# EAGLE design Smarttree_CMU_4 (EAGLE 7.3.0)
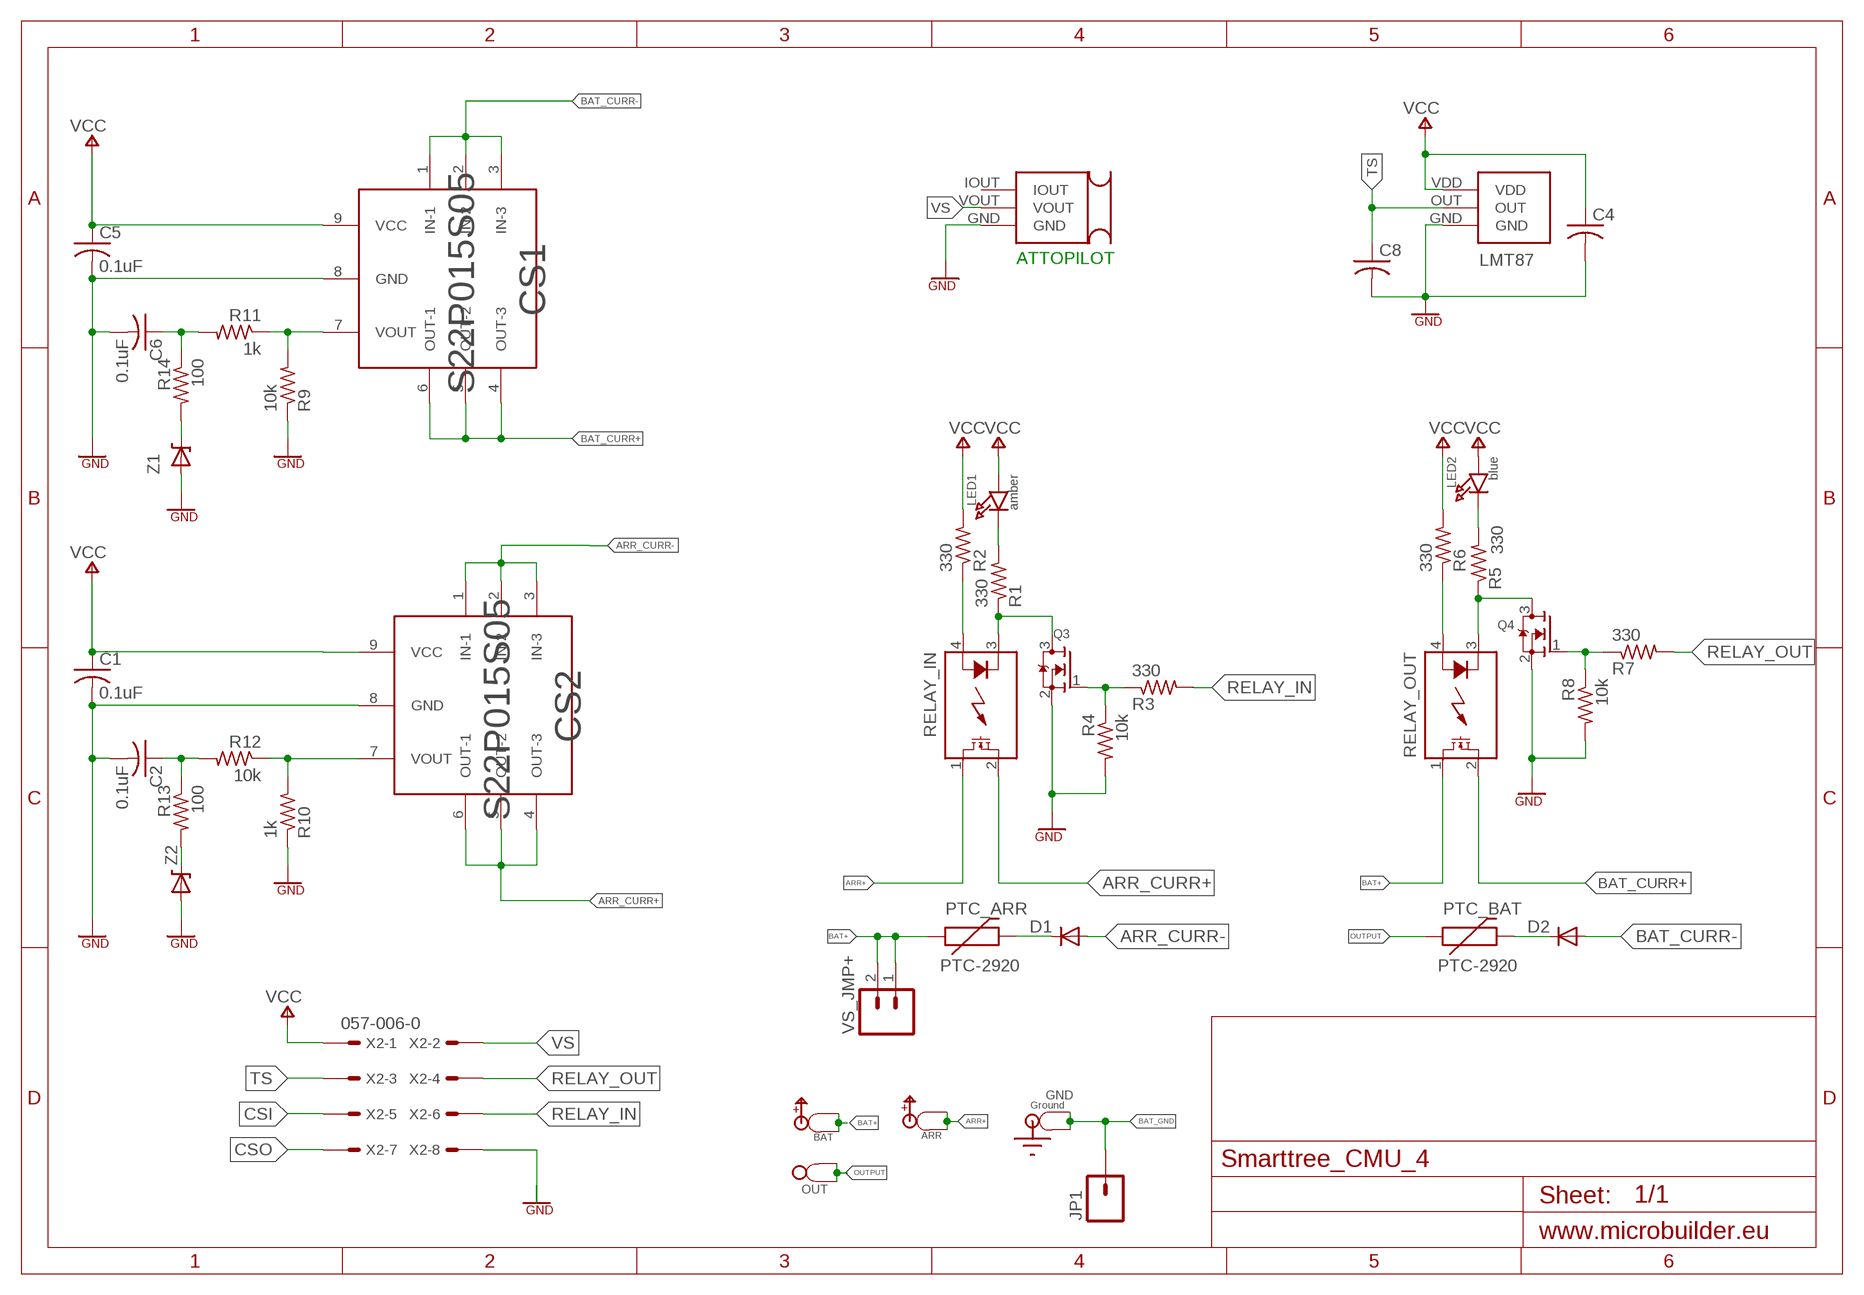
[diagram p0: schematic, sheet 1]

## Parts
ARR  SPADE-POWER  [SPADE-POWER]
ATTOPILOT  ATTOPILOT_VOLT  [TH_BKOT]
BAT  SPADE-POWER  [SPADE-POWER]
C1  0.1uF  C-USC0805  [C0805]
C2  0.1uF  C-USC0805  [C0805]
C4  C-USC0805  [C0805]
C5  0.1uF  C-USC0805  [C0805]
C6  0.1uF  C-USC0805  [C0805]
C8  C-USC0805  [C0805]
CS1  S22P015S05  [S22P015S05]
CS2  S22P015S05  [S22P015S05]
D1  DIODE-SOD106-R  [SOD106-R]
D2  DIODE-SOD106-R  [SOD106-R]
GND  SPADE-GROUND  [SPADE-GROUND]
JP1  M01OFFSET  [1X01_OFFSET]
LED1  amber  LED0805  [CHIPLED_0805]
LED2  blue  LED0805  [CHIPLED_0805]
LMT87  LMT87_PAC  [LMT87_TO]
OUT  SPADE-TERMINALPTH  [SPADE-TERMINAL]
PTC_ARR  PTC-2920  [PTC-2920]
PTC_BAT  PTC-2920  [PTC-2920]
Q3  MOSFET-NREFLOW  [SOT23]
Q4  MOSFET-NREFLOW  [SOT23]
R1  330  R-US_R0805  [R0805]
R2  330  R-US_R0805  [R0805]
R3  330  R-US_R0805  [R0805]
R4  10k  R-US_R0805  [R0805]
R5  330  R-US_R0805  [R0805]
R6  330  R-US_R0805  [R0805]
R7  330  R-US_R0805  [R0805]
R8  10k  R-US_R0805  [R0805]
R9  10k  R-US_R0805  [R0805]
R10  1k  R-US_R0805  [R0805]
R11  1k  R-US_R0805  [R0805]
R12  10k  R-US_R0805  [R0805]
R13  100  R-US_R0805  [R0805]
R14  100  R-US_R0805  [R0805]
RELAY_IN  CPC1708J  [I4-PAC]
RELAY_OUT  CPC1708J  [I4-PAC]
VS_JMP+  M02  [1X02_LONGPADS]
X2  057-006-0  [057-006-0]
Z1  DIODE-ZENER-BZT52  [SOD-323]
Z2  DIODE-ZENER-BZT52  [SOD-323]

## Nets
ARR+ [Power]: ARR.P$1 ARR.P$2 RELAY_IN.1(DS1)
ARR_CURR+ [Power]: CS2.4(OUT-3) CS2.5(OUT-2) CS2.6(OUT-1) RELAY_IN.2(DS2)
ARR_CURR- [Power]: CS2.1(IN-1) CS2.2(IN-2) CS2.3(IN-3) D1.A
BAT+ [Power]: BAT.P$1 BAT.P$2 PTC_ARR.1 RELAY_OUT.1(DS1) VS_JMP+.1 VS_JMP+.2
BAT_CURR+ [Power]: CS1.4(OUT-3) CS1.5(OUT-2) CS1.6(OUT-1) RELAY_OUT.2(DS2)
BAT_CURR-: CS1.1(IN-1) CS1.2(IN-2) CS1.3(IN-3) D2.A
BAT_GND [Power]: GND.P$1 GND.P$2 JP1.1
CSI: C2.1 R12.2 R13.1 X2.5
CSO: C6.1 R11.2 R14.1 X2.8
GND: ATTOPILOT.GND C1.2 C2.2 C4.2 C5.2 C6.2 C8.2 CS1.8(GND) CS2.8(GND) LMT87.GND Q3.2(S) Q4.2(S) R4.2 R8.2 R9.1 R10.1 X2.7 Z1.2(A) Z2.2(A)
N$1: Q3.3(D) R1.1 RELAY_IN.3(K)
N$2: Q4.3(D) R5.1 RELAY_OUT.3(K)
N$3: LED1.C R1.2
N$4: R2.1 RELAY_IN.4(A)
N$5: LED2.C R5.2
N$6: Q3.1(G) R3.1 R4.1
N$7: R6.1 RELAY_OUT.4(A)
N$8: Q4.1(G) R7.1 R8.1
N$9: R13.2 Z2.1(C)
N$10 [Power]: D2.C PTC_BAT.2
N$11 [Power]: D1.C PTC_ARR.2
N$12: CS1.7(VOUT) R9.2 R11.1
N$13: CS2.7(VOUT) R10.2 R12.1
N$14: R14.2 Z1.1(C)
OUTPUT [Power]: OUT.P$1 OUT.P$2 PTC_BAT.1
RELAY_IN: R3.2 X2.6
RELAY_OUT: R7.2 X2.4
TS: C8.1 LMT87.OUT X2.3
VCC: C1.1 C4.1 C5.1 CS1.9(VCC) CS2.9(VCC) LED1.A LED2.A LMT87.VDD R2.2 R6.2 X2.1 ; supply symbol labelled 5V
VS: ATTOPILOT.VOUT X2.2
Unconnected: ATTOPILOT.IOUT

## Library data of the parts
ARR BAT = Spade-terminals:SPADE-POWER: 0.25" SPADE
ATTOPILOT = Francis-Project:ATTOPILOT_VOLT
C1 C2 C4-C6 C8 = adafruit:C-US: CAPACITOR, American symbol
CS1 CS2 = Allen:S22P015S05
D1 D2 = diode:DIODE-: DIODE
GND = Spade-terminals:SPADE-GROUND: 0.25" spade terminal
JP1 = SparkFun:M01: Header 1 Standard 1-pin 0.1" header. Use with straight break away headers (SKU : PRT-00116), right angle break away headers (PRT-00553), swiss pins (PRT-00743), machine pins (PRT-00117), and female headers (PRT-00115).
LED1 LED2 = microbuilder:LED: LED 0603 - 0603 Surface Mount Package 2mA: Green LED - Low Power (3.9mcd, 2ma, 1.7Vf) - Digikey: 475-2709-2-ND Orange LED - Low Power (9.8mcd, 2ma, 1.8Vf) - Digikey: 475-1194-2-ND Red LED - Low Power (5mcd, 2ma, 1.8Vf) - Digikey: 475-1195-2-ND Yellow LED - Low Power (7mcd, 2ma, 1.8Vf) - Digikey: 475-1196-2-ND 5mA: Blue LED - Low Power (17mcd, 5ma, 2.9Vf) - Digikey: LNJ937W8CRACT-ND 0805 - 0805 Surface Mount Package 2mA: Red LED (8.8mcd, 2mA, 1.8Vf, Clear) - Low Power [Digikey: 475-2510-1-ND] Green LED (5mcd, 2mA, 1.8Vf, Clear) - Low Power [Digikey: 475-2730-1-ND] Yellow LED (11.3mcd, 2mA, 1.8Vf, Clear) - Low Power [Digikey: 475-2555-1-ND] 20mA: Red LED (104mcd, 20mA, Diffused) - LS R976 [Digikey: 475-1278-6-ND] Red LED (12mcd, 20mA, 2.0Vf, Clear) - APT2012EC [Digikey: 754-1128-1-ND] Green LED (15mcd, 20mA, 2.2Vf, Clear) - APT2012GC [Digikey: 754-1131-1-ND] Orange LED (160mcd, 20mA, 2.1Vf, Clear) - APT2012SECK [Digikey: 754-1130-1-ND] 1206 - 1206 Surface Mount Package Green LED (26mcd, 20mA, Diffused) - LG N971 [Digikey: 475-1407-6-ND] Red LED (15mcd, 20mA, Diffused) - LH N974 [Digikey: 475-1416-6-ND]
LMT87 = nick:LMT87_PAC
OUT = Spade-terminals:SPADE-TERMINAL: 0.25" Spade,with connections for both legs, Pls share any updates with mosaicmerc@yahoo.com
PTC_ARR PTC_BAT = SparkFun:PTC-2920
Q3 Q4 = adafruit:MOSFET-N: N-Channel Mosfet 2N7002E - 60V 260mA SOT23 [Digikey: 2N7002ET1GOSTR-ND] - REEL BSH103 - 30V 850mA SOT23 [Digikey: 568-5013-1-ND]
R1-R14 = adafruit:R-US_: RESISTOR, American symbol
RELAY_IN RELAY_OUT = relay:CPC1708J: Single-Pole, Normally Open i4-PAC (TM) DC Power Relay Source: Data sheet <http://www.clare.com/home/pdfs.nsf/www/CPC1708.pdf/$file/CPC1708.pdf>
VS_JMP+ = SparkFun:M02: Header 2 Standard 2-pin 0.1" header. Use with straight break away headers (SKU : PRT-00116), right angle break away headers (PRT-00553), swiss pins (PRT-00743), machine pins (PRT-00117), and female headers (PRT-00115). Molex polarized connector foot print use with SKU : PRT-08233 with associated crimp pins and housings.
X2 = con-panduit:057-006-: CONNECTOR 6-pin series 057 contact pc board low profile headers
Z1 Z2 = SparkFun:DIODE-ZENER: Zener Diode Production Part - 8199 3.4V Zener Voltage

## Net classes
0 default: width 0.406 mm, clearance 0.127 mm
1 Power: width 2.54 mm, clearance 0.635 mm

## Board
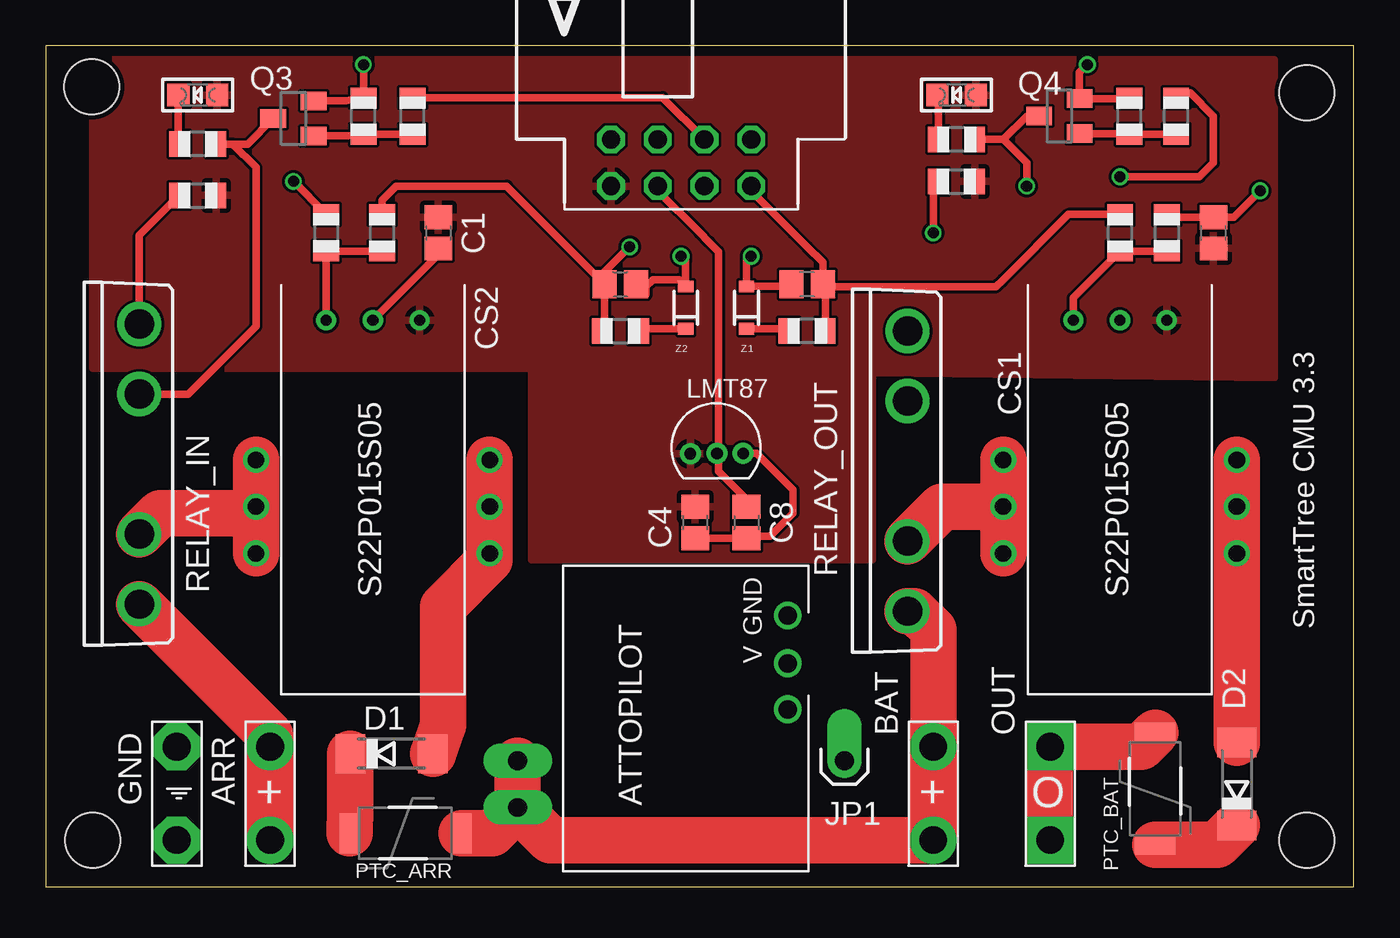
[diagram p1: board, top side]
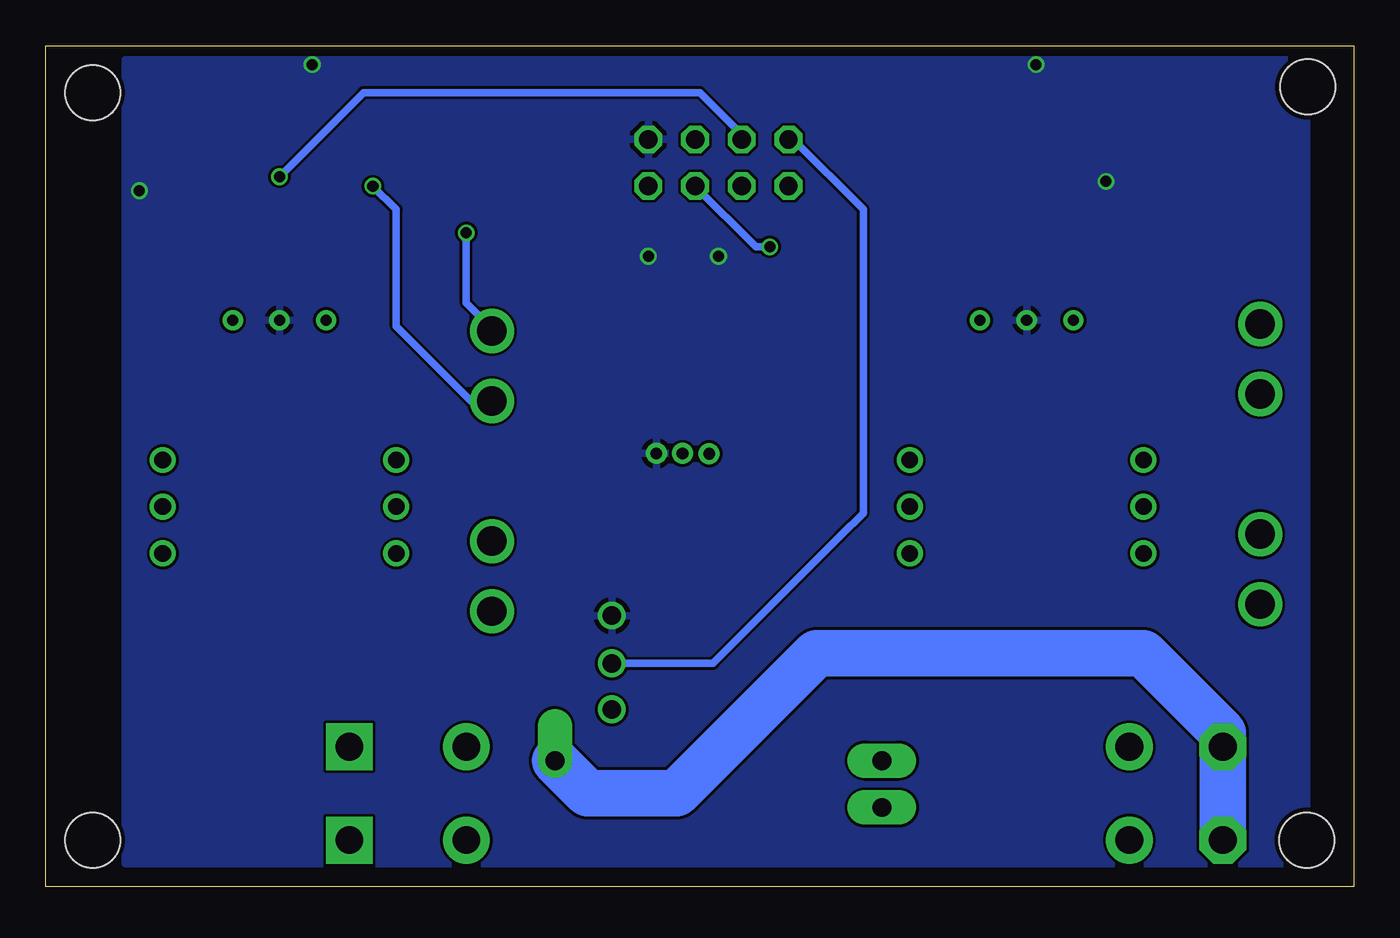
[diagram p2: board, bottom side, seen from below]

Size 71.12 x 45.72 mm. Coordinates in mm from the lower left corner, seen from the top.
Outline: 0,0 71.12,0 71.12,45.72 0,45.72 0,0
Copper layers (1*16): Top 0.035mm / dielectric 1.5mm / Bottom 0.035mm
Design rules "SeeedStudio_2layer_DRU_no_angle_20140221": minimum track width 6mil, minimum drill 12mil, track to track 6mil, track to pad 6mil, pad to pad 6mil, via to via 6mil, smd to smd 0mil, copper to edge 10mil, drill to drill 10mil, minimum pad ring 10mil, minimum via ring 6mil, stop-mask expansion 2mil, vias tented up to drill 100mil, thermal gap 10mil
Holes 3 mm at 2.5,43.5 68.58,43.18 68.58,2.54 2.54,2.54

### Footprints (pad centres in the part's own frame; a part is rotated, then mirrored left to right if it is on the bottom)
SPADE-POWER = drill 1.5 pad 2.54: P$1 0,-2.54; P$2 0,2.54
TH_BKOT = drill 1: GND 5.1,-4.4; IOUT 0,-4.4; VOUT 2.5,-4.4
C0805 = smd 1.3 x 1.5: 1 -0.85,0; 2 0.85,0
S22P015S05 = drill 0.9: 1 -6.35,-1.62; 2 -6.35,0.92; 3 -6.35,3.46; 4 6.35,3.46; 5 6.35,0.92; 6 6.35,-1.62 | drill 0.6: 7 2.54,-9.22; 8 0,-9.22; 9 -2.54,-9.22
SOD106-R = smd 1.6 x 2.1: A 2.25,0; C -2.25,0
SPADE-GROUND = drill 1.5 pad 2.54 octagon: P$1 0,-2.54; P$2 0,2.54
1X01_OFFSET = drill 1.016 pad 1.88 offset: 1 0,0
CHIPLED_0805 = smd 1.2 x 1.2: A 0,-1.05; C 0,1.05
LMT87_TO = drill 0.635: GND 0.305,-1.346; OUT 1.727,-1.346; VDD 3.175,-1.321
SPADE-TERMINAL = drill 1.5 pad 2.54 square: P$1 0,-2.54; P$2 0,2.54
PTC-2920 = smd 1.067 x 2.184: 1 -2.032,0.638; 2 4.064,0.638
SOT23 = smd 1 x 1.4: 1 -0.95,-1.1; 2 0.95,-1.1; 3 0,1.1
R0805 = smd 1.1 x 1.4: 1 -1,0; 2 1,0
I4-PAC = drill 1.6 pad 2.3: 1 -7.62,0; 2 -3.81,0; 3 3.81,0; 4 7.62,0
1X02_LONGPADS = drill 1.016 pad 1.88 long: 1 0,0; 2 2.54,0
057-006-0 = drill 1 octagon: 1 -2.54,-5.08; 2 -2.54,-2.54; 3 0,-5.08; 4 0,-2.54; 5 2.54,-5.08; 6 2.54,-2.54; 7 5.08,-2.54; 8 5.08,-5.08
SOD-323 = smd 0.63 x 0.83: 1 -1.15,0; 2 1.15,0

### Placement (x,y rotation side)
ARR  12.19,5.08 0 top
ATTOPILOT  35.94,9.65 90 top
BAT  48.26,5.08 0 top
C1  21.34,35.56 270 top
C2  31.24,32.77 0 top
C4  35.31,19.81 270 top
C5  63.5,35.56 90 top
C6  41.4,32.77 180 top
C8  38.1,19.81 270 top
CS1  58.42,21.59 180 top
CS2  17.78,21.59 180 top
D1  18.8,7.24 0 top
D2  64.77,5.59 90 top
GND  7.11,5.08 0 top
JP1  43.43,6.86 0 top
LED1  8.26,43.05 90 top
LED2  49.53,43.05 90 top
LMT87  38.23,22.23 180 top
OUT  54.61,5.08 0 top
PTC_ARR  20.57,3.56 180 top
PTC_BAT  59.69,6.35 270 top
Q3  13.46,41.78 90 top
Q4  55.12,41.91 90 top
R1  8.26,40.39 180 top
R2  8.26,37.59 0 top
R3  19.94,41.91 90 top
R4  17.27,41.91 90 top
R5  49.53,40.64 180 top
R6  49.53,38.35 0 top
R7  61.47,41.91 90 top
R8  58.93,41.91 90 top
R9  60.96,35.56 270 top
R10  15.24,35.56 270 top
R11  58.42,35.56 90 top
R12  18.29,35.56 90 top
R13  31.24,30.23 0 top
R14  41.4,30.23 180 top
RELAY_IN  5.08,22.99 90 top
RELAY_OUT  46.86,22.61 90 top
VS_JMP+  25.65,4.32 90 top
X2  33.27,43.18 0 top
Z1  38.1,31.5 90 top
Z2  34.8,31.5 90 top

### Tracks (layer width: path | path; a pad name or v marks a point on that pad's centre or on a via)
ARR+
  Top 2.54: RELAY_IN.1 12.19,8.26 ARR.P$2 ARR.P$1
ARR_CURR+
  Top 2.54: CS2.6 CS2.5 | CS2.5 11.43,20.32 | 11.43,20.32 CS2.4 | RELAY_IN.2 6.22,20.32 11.43,20.32 | 11.43,20.32 CS2.5
ARR_CURR-
  Top 2.54: D1.A 21.59,8.8 21.59,15.24 24.13,17.78 CS2.3 CS2.2 CS2.1
BAT+
  Top 2.54: RELAY_OUT.1 47.24,14.99 48.26,13.97 BAT.P$2 BAT.P$1 29.46,2.54 29.21,2.54 27.43,2.54 VS_JMP+.1 | PTC_ARR.1 24.25,2.92 VS_JMP+.1 | VS_JMP+.1 VS_JMP+.2
BAT_CURR+
  Top 2.54: RELAY_OUT.2 48.74,20.67 CS1.5 | CS1.5 CS1.6 | CS1.5 CS1.4
BAT_CURR-
  Top 2.54: CS1.1 CS1.2 CS1.3 D2.A
BAT_GND
  Bottom 2.54: GND.P$1 GND.P$2 7.11,8.38 11.43,12.7 29.21,12.7 36.83,5.08 41.66,5.08 JP1.1
CSI  (via drill 0.6)
  Top 0.406: R12.2 18.29,37.34 19.05,38.1 25.06,38.1 C2.1 | C2.1 30.39,33.44 v31.75,34.8 | C2.1 30.39,30.38 R13.1
  Bottom 0.406: v31.75,34.8 32.51,34.8 X2.5
CSO
  Top 0.406: R11.2 55.61,36.56 52.07,33.02 51.67,32.62 42.4,32.62 | X2.8 38.35,37.85 40.64,35.56 41.4,34.8 42.25,33.95 C6.1 42.4,32.62 | R14.1 42.4,32.62
GND  (via drill 0.6)
  Top 0.406: Q3.2 16.33,42.73 R4.2 v17.27,44.7 | LMT87.GND 38.66,23.57 40.64,21.59 40.64,20.32 39.37,19.05 38.19,19.05 C8.2 C4.2 | R9.1 61.11,36.41 C5.2 64.6,36.41 v66.04,37.85 | C1.2 21.34,34.37 CS2.8 | R10.1 15.24,36.58 v13.46,38.35 | C2.2 32.65,32.21 32.65,32.65 33.02,33.02 34.42,33.02 Z2.2 34.8,34.04 v34.54,34.29 | v56.64,44.7 56.22,44.28 Q4.2 58.88,42.86 R8.2 | C6.2 40.43,32.65 Z1.2 38.1,34.04 v38.35,34.29
  pour Bottom: 2.54,44.96 2.54,1.27 66.8,1.27 66.8,44.96
N$1
  Top 0.406: R1.1 10.16,40.39 | 10.16,40.39 10.96,40.39 Q3.3 | RELAY_IN.3 7.75,26.8 11.43,30.48 11.43,39.12 10.16,40.39
N$2  (via drill 0.6)
  Top 0.406: v53.34,38.1 53.34,39.37 52.07,40.64 | 52.07,40.64 R5.1 | Q4.3 53.34,41.91 52.07,40.64
  Bottom 0.406: RELAY_OUT.3 48.01,26.42 52.07,30.48 52.07,36.83 v53.34,38.1
N$3
  Top 0.406: LED1.C 7.21,40.44 R1.2
N$4
  Top 0.406: RELAY_IN.4 5.08,35.42 R2.1
N$5
  Top 0.406: LED2.C 48.53,43.05 R5.2
N$6
  Top 0.406: Q3.1 16.43,40.83 R4.1 R3.1
N$7  (via drill 0.6)
  Top 0.406: v48.26,35.56 48.26,38.08 R6.1
  Bottom 0.406: RELAY_OUT.4 46.86,30.35 48.26,31.75 v48.26,35.56
N$8
  Top 0.406: Q4.1 58.88,40.96 R8.1 R7.1
N$9
  Top 0.406: Z2.1 32.36,30.35 R13.2
N$10
  Top 2.54: D2.C 63.72,2.29 PTC_BAT.2
N$11
  Top 2.54: PTC_ARR.2 16.55,4.22 D1.C
N$12
  Top 0.406: CS1.7 55.88,32.02 R11.1 R9.2
N$13
  Top 0.406: CS2.7 R10.2 R12.1
N$14
  Top 0.406: Z1.1 40.28,30.35 R14.2
OUTPUT
  Top 2.54: PTC_BAT.1 59.57,7.62 OUT.P$2 OUT.P$1
RELAY_IN
  Top 0.406: R3.2 33.54,42.91 X2.6
RELAY_OUT  (via drill 0.6)
  Top 0.406: v58.42,38.61 62.74,38.61 63.5,39.37 63.5,41.91 62.23,43.18 61.74,43.18 R7.2
  Bottom 0.406: X2.4 33.27,40.89 35.56,43.18 53.85,43.18 v58.42,38.61
TS
  Top 0.406: C8.1 38.1,21.08 36.58,22.61 36.58,23.5 LMT87.OUT 36.58,23.65 36.58,34.54 36.07,35.05 35.56,35.56 33.27,37.85 X2.3
VCC
  pour Top: 2.54,44.96 2.54,28.19 26.42,28.19 26.42,17.78 44.96,17.78 44.96,27.94 66.8,27.69 66.8,44.96
VS
  Bottom 0.406: ATTOPILOT.VOUT 37.38,12.15 34.84,12.15 27.94,19.05 26.67,20.32 26.67,36.83 30.48,40.64 X2.2

### Text on the board
tNames: SmartTree CMU 3.3
Document: Digital Isolator (optocoupler) for Voltage sensor / Spacing of spade terminal